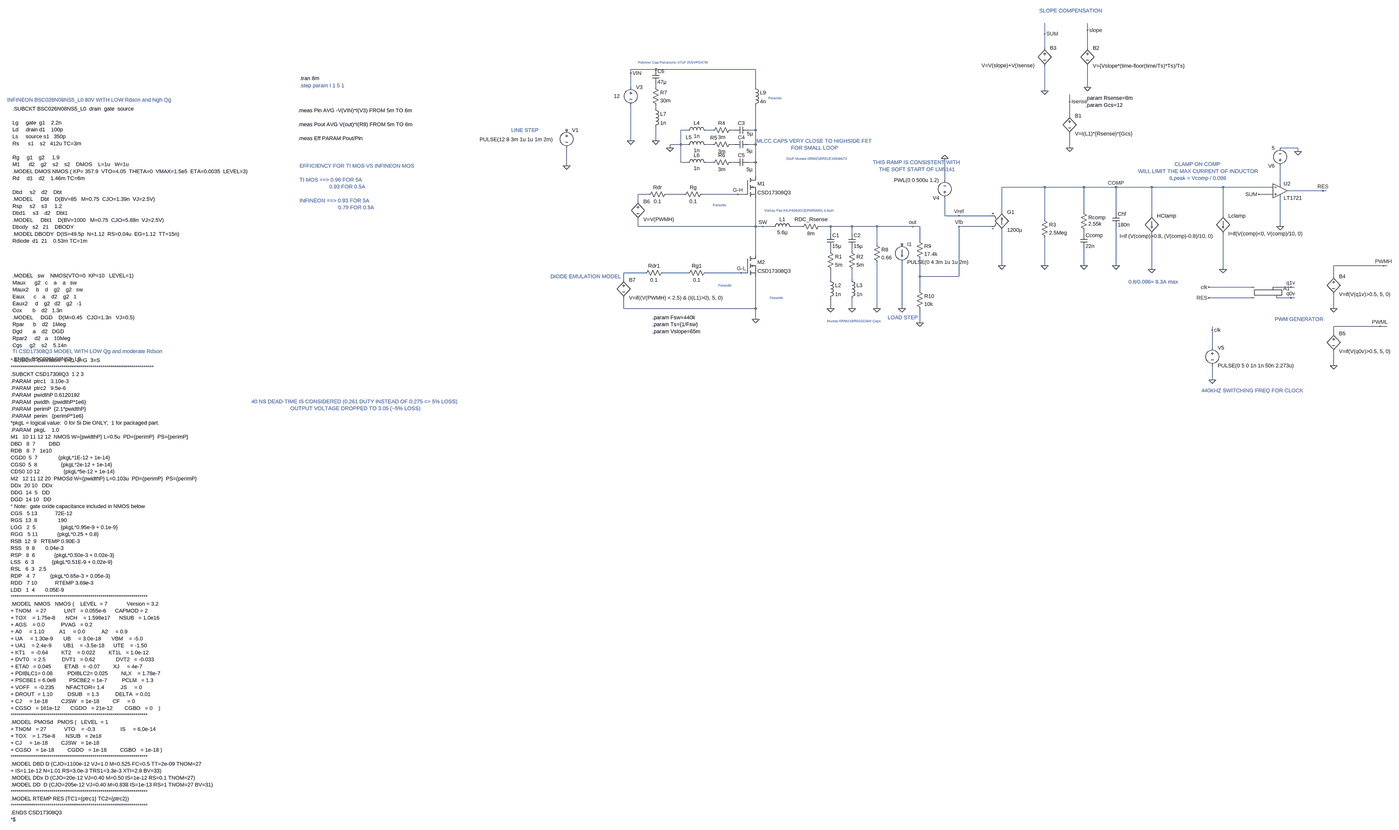
[diagram p0: schematic Synchronos Buck Converter.asc, whole sheet]
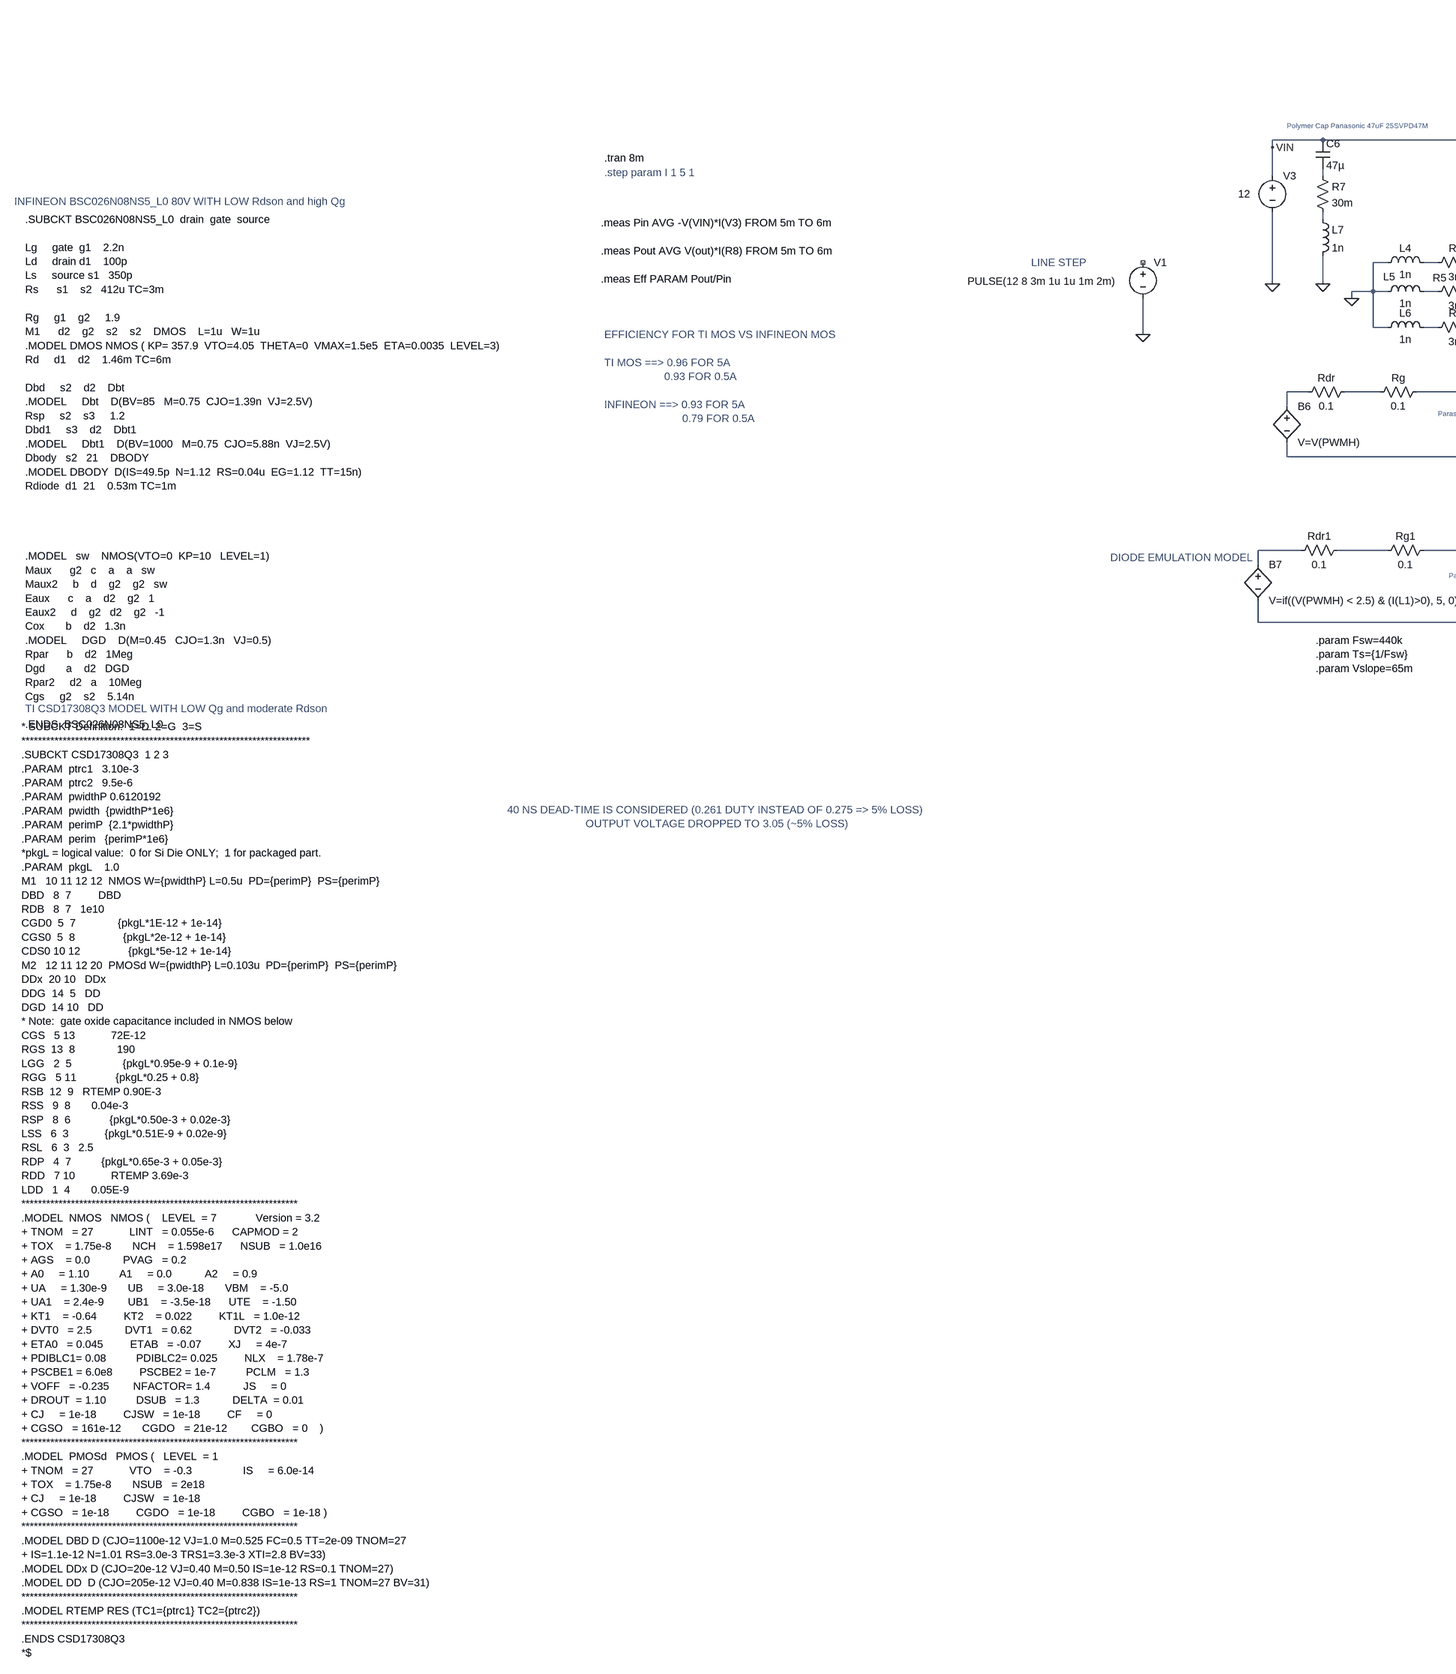
[diagram p1: schematic Synchronos Buck Converter.asc, part, row 1 of 1, column 1 of 2]
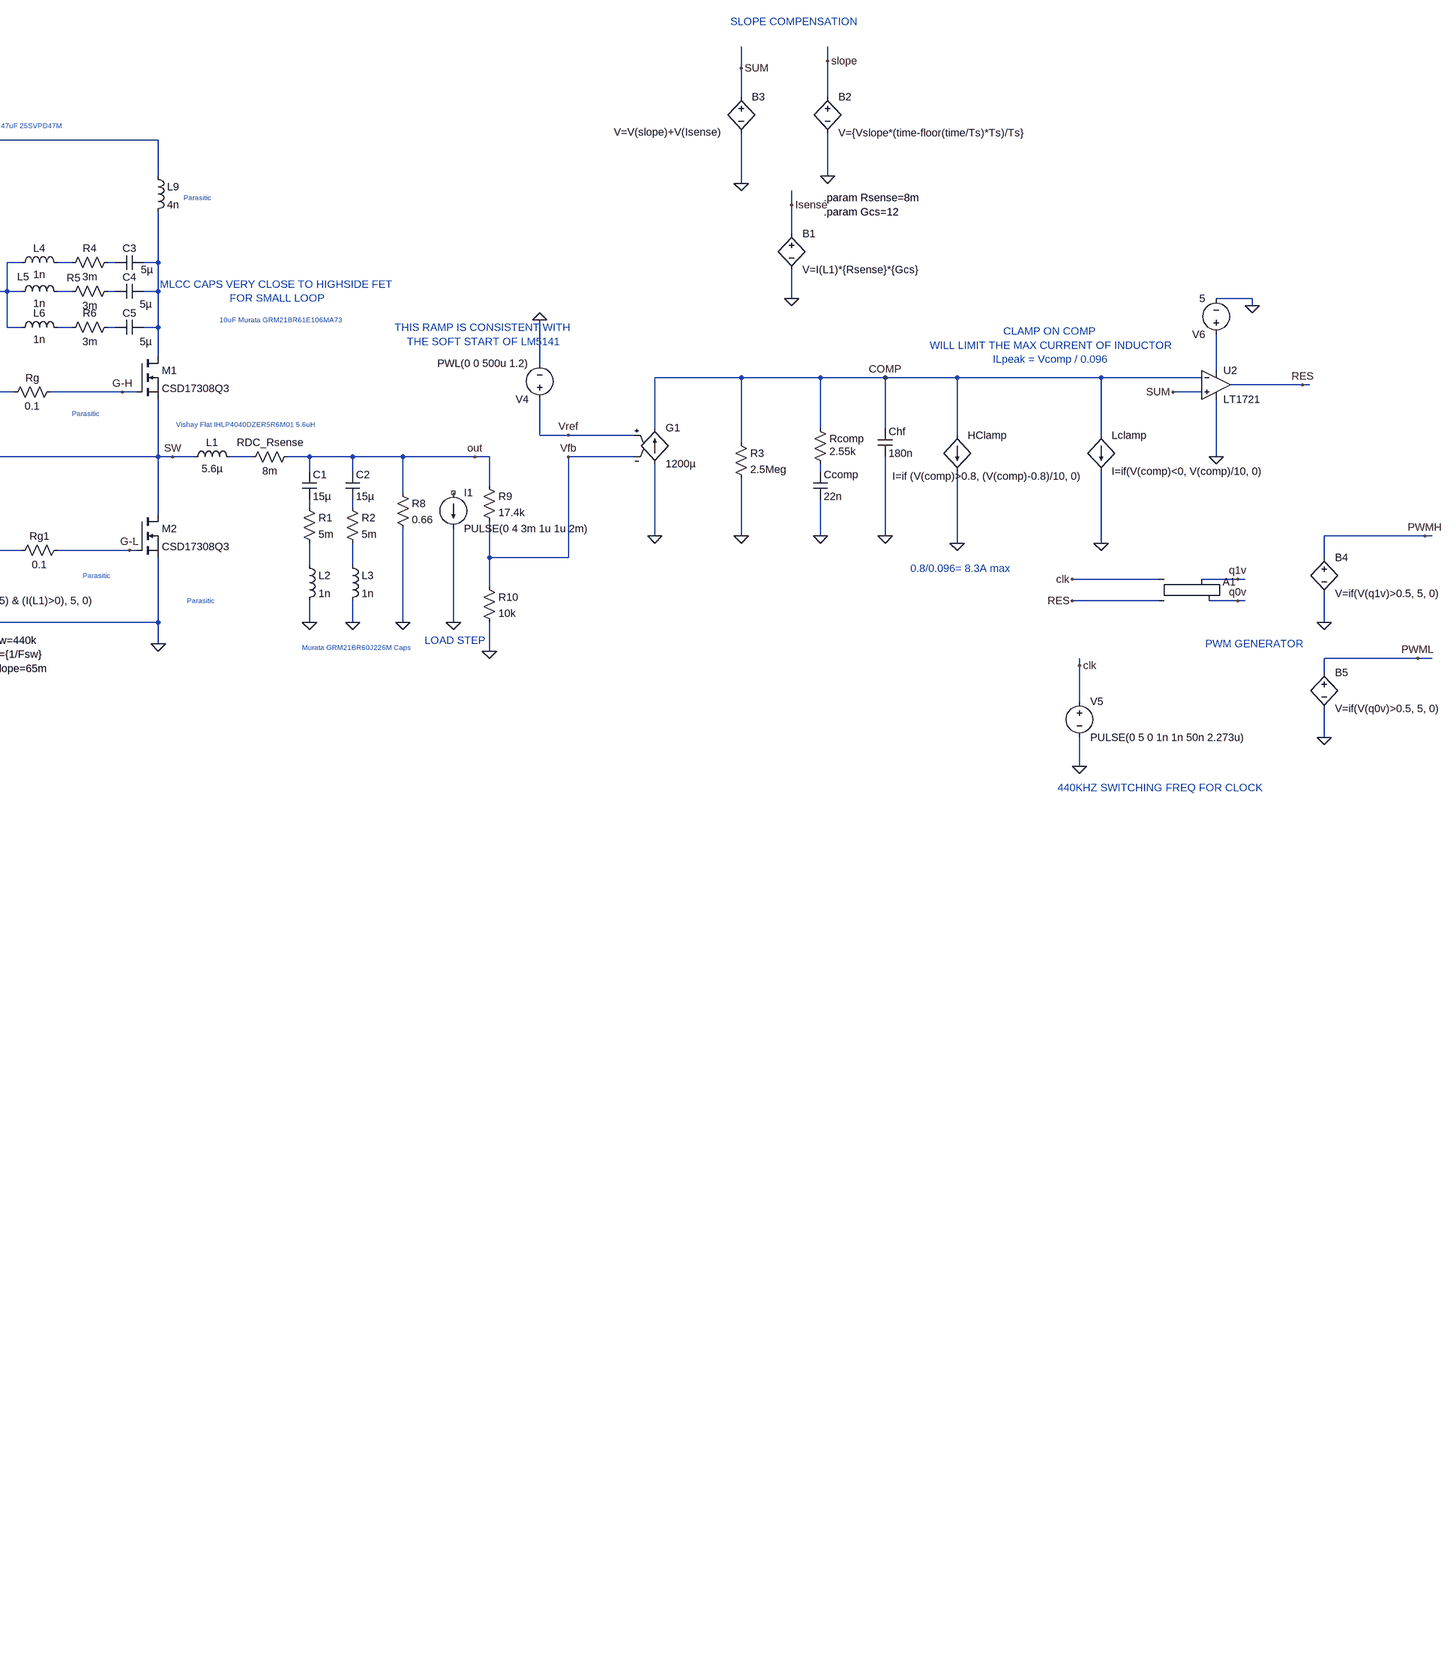
[diagram p2: schematic Synchronos Buck Converter.asc, part, row 1 of 1, column 2 of 2]
Synchronos Buck Converter.asc, the LTspice schematic file:
Version 4.1
SHEET 1 2240 2848
WIRE 848 -496 848 -528
WIRE 656 -480 656 -528
WIRE 656 -416 656 -480
WIRE 848 -416 848 -496
WIRE -1088 -320 -1200 -320
WIRE -640 -320 -1088 -320
WIRE -1200 -304 -1200 -320
WIRE -1200 -240 -1200 -304
WIRE -1088 -240 -1088 -256
WIRE -640 -240 -640 -320
WIRE 848 -240 848 -336
WIRE 656 -224 656 -336
WIRE 768 -176 768 -208
WIRE -1088 -144 -1088 -160
WIRE 768 -112 768 -176
WIRE -944 -48 -976 -48
WIRE -832 -48 -864 -48
WIRE -736 -48 -752 -48
WIRE -640 -48 -640 -160
WIRE -640 -48 -672 -48
WIRE -1200 0 -1200 -160
WIRE -1088 0 -1088 -64
WIRE -976 16 -976 -48
WIRE -976 16 -1024 16
WIRE -944 16 -976 16
WIRE -832 16 -864 16
WIRE -736 16 -752 16
WIRE -640 16 -640 -48
WIRE -640 16 -672 16
WIRE -1024 32 -1024 16
WIRE 768 32 768 -32
WIRE 1792 32 1712 32
WIRE 1792 48 1792 32
WIRE -976 96 -976 16
WIRE -944 96 -976 96
WIRE -832 96 -864 96
WIRE -736 96 -752 96
WIRE -640 96 -640 16
WIRE -640 96 -672 96
WIRE -1488 112 -1488 32
WIRE -640 160 -640 96
WIRE 208 176 208 80
WIRE 1712 192 1712 112
WIRE 656 208 464 208
WIRE 832 208 656 208
WIRE 976 208 832 208
WIRE 1136 208 976 208
WIRE 1456 208 1136 208
WIRE 1680 208 1456 208
WIRE 1904 224 1744 224
WIRE 1920 224 1904 224
WIRE -1120 240 -1168 240
WIRE -960 240 -1040 240
WIRE -720 240 -880 240
WIRE -688 240 -720 240
WIRE 1680 240 1616 240
WIRE -1168 272 -1168 240
WIRE 464 320 464 208
WIRE 832 320 832 208
WIRE 976 320 976 208
WIRE 208 336 208 256
WIRE 272 336 208 336
WIRE 416 336 272 336
WIRE 1136 336 1136 208
WIRE 1456 336 1456 208
WIRE 656 352 656 208
WIRE -1168 384 -1168 352
WIRE -640 384 -640 256
WIRE -640 384 -1168 384
WIRE -608 384 -640 384
WIRE -560 384 -608 384
WIRE -432 384 -480 384
WIRE -304 384 -352 384
WIRE -208 384 -304 384
WIRE -96 384 -208 384
WIRE 64 384 -96 384
WIRE 96 384 64 384
WIRE 416 384 272 384
WIRE 1712 384 1712 256
WIRE -304 416 -304 384
WIRE -208 416 -208 384
WIRE 832 416 832 400
WIRE 96 448 96 384
WIRE -96 464 -96 384
WIRE -304 496 -304 480
WIRE -208 496 -208 480
WIRE -640 512 -640 384
WIRE 464 560 464 400
WIRE 656 560 656 432
WIRE 832 560 832 480
WIRE 976 560 976 384
WIRE 2176 560 1952 560
WIRE 2192 560 2176 560
WIRE 1136 576 1136 416
WIRE 1456 576 1456 416
WIRE -1136 592 -1232 592
WIRE -944 592 -1056 592
WIRE -704 592 -864 592
WIRE -688 592 -704 592
WIRE 96 608 96 528
WIRE 272 608 272 384
WIRE 272 608 96 608
WIRE 1952 608 1952 560
WIRE -1232 624 -1232 592
WIRE -304 624 -304 576
WIRE -208 624 -208 576
WIRE 1584 656 1392 656
WIRE 1760 656 1680 656
WIRE 1776 656 1760 656
WIRE 96 672 96 608
WIRE 1584 704 1392 704
WIRE 1760 704 1696 704
WIRE 1776 704 1760 704
WIRE -1232 752 -1232 704
WIRE -640 752 -640 608
WIRE -640 752 -1232 752
WIRE -304 752 -304 704
WIRE -208 752 -208 704
WIRE -96 752 -96 544
WIRE 16 752 16 544
WIRE 1952 752 1952 688
WIRE -640 800 -640 752
WIRE 96 816 96 752
WIRE 2160 832 1952 832
WIRE 2192 832 2160 832
WIRE 1408 848 1408 832
WIRE 1952 864 1952 832
WIRE 1408 928 1408 848
WIRE 1952 1008 1952 944
WIRE 1408 1072 1408 1008
FLAG -640 800 0
FLAG -1200 0 0
FLAG -304 752 0
FLAG -208 752 0
FLAG -1024 32 0
FLAG -1088 0 0
FLAG -720 240 G-H
FLAG -704 592 G-L
FLAG -608 384 SW
FLAG 272 336 Vref
FLAG 272 384 Vfb
FLAG 976 208 COMP
FLAG 464 560 0
FLAG 208 80 0
FLAG 96 816 0
FLAG 832 560 0
FLAG 976 560 0
FLAG 1408 848 clk
FLAG 1408 1072 0
FLAG 768 32 0
FLAG 768 -176 Isense
FLAG -96 752 0
FLAG 848 -496 slope
FLAG 848 -240 0
FLAG 656 -224 0
FLAG 656 -480 SUM
FLAG 656 560 0
FLAG 1616 240 SUM
FLAG 1792 48 0
FLAG 1904 224 RES
FLAG 1392 656 clk
FLAG 1392 704 RES
FLAG 1760 656 q1v
FLAG 1952 752 0
FLAG 2176 560 PWMH
FLAG 1952 1008 0
FLAG 1760 704 q0v
FLAG 2160 832 PWML
FLAG 64 384 out
FLAG 1712 384 0
FLAG 16 752 0
FLAG 1136 576 0
FLAG 1456 576 0
FLAG -1488 112 0
FLAG -1200 -304 VIN
DATAFLAG 848 -448 ""
SYMBOL voltage -1200 -256 R0
WINDOW 123 0 0 Left 0
WINDOW 39 0 0 Left 0
WINDOW 3 -76 56 Left 2
SYMATTR Value 12
SYMATTR InstName V3
SYMBOL nmos -688 160 R0
SYMATTR InstName M1
SYMATTR Value CSD17308Q3
SYMATTR Prefix X
SYMBOL nmos -688 512 R0
SYMATTR InstName M2
SYMATTR Value CSD17308Q3
SYMATTR Prefix X
SYMBOL ind -576 400 R270
WINDOW 0 32 56 VTop 2
WINDOW 3 5 56 VBottom 2
SYMATTR InstName L1
SYMATTR Value 5.6µ
SYMATTR SpiceLine Rser=1m
SYMBOL cap -320 416 R0
SYMATTR InstName C1
SYMATTR Value 15µ
SYMBOL cap -224 416 R0
SYMATTR InstName C2
SYMATTR Value 15µ
SYMBOL res -320 480 R0
SYMATTR InstName R1
SYMATTR Value 5m
SYMBOL ind -320 608 R0
SYMATTR InstName L2
SYMATTR Value 1n
SYMATTR SpiceLine Rser=0
SYMBOL ind -224 608 R0
SYMATTR InstName L3
SYMATTR Value 1n
SYMATTR SpiceLine Rser=0
SYMBOL res -224 480 R0
SYMATTR InstName R2
SYMATTR Value 5m
SYMBOL res -336 368 R90
WINDOW 0 0 56 VBottom 2
WINDOW 3 32 56 VTop 2
SYMATTR InstName RDC_Rsense
SYMATTR Value 8m
SYMBOL cap -672 -64 R90
WINDOW 0 0 32 VBottom 2
WINDOW 3 16 -7 VTop 2
SYMATTR InstName C3
SYMATTR Value 5µ
SYMBOL cap -672 0 R90
WINDOW 0 0 32 VBottom 2
WINDOW 3 29 -4 VTop 2
SYMATTR InstName C4
SYMATTR Value 5µ
SYMBOL cap -672 80 R90
WINDOW 0 0 32 VBottom 2
WINDOW 3 32 -4 VTop 2
SYMATTR InstName C5
SYMATTR Value 5µ
SYMBOL res -736 -64 R90
WINDOW 0 0 56 VBottom 2
WINDOW 3 32 56 VTop 2
SYMATTR InstName R4
SYMATTR Value 3m
SYMBOL ind -960 -32 R270
WINDOW 0 32 56 VTop 2
WINDOW 3 5 56 VBottom 2
SYMATTR InstName L4
SYMATTR Value 1n
SYMATTR SpiceLine Rser=0
SYMBOL ind -960 32 R270
WINDOW 0 33 20 VTop 2
WINDOW 3 5 56 VBottom 2
SYMATTR InstName L5
SYMATTR Value 1n
SYMATTR SpiceLine Rser=0
SYMBOL ind -960 112 R270
WINDOW 0 32 56 VTop 2
WINDOW 3 5 56 VBottom 2
SYMATTR InstName L6
SYMATTR Value 1n
SYMATTR SpiceLine Rser=0
SYMBOL res -736 0 R90
WINDOW 0 2 92 VBottom 2
WINDOW 3 32 56 VTop 2
SYMATTR InstName R5
SYMATTR Value 3m
SYMBOL res -736 80 R90
WINDOW 0 0 56 VBottom 2
WINDOW 3 32 56 VTop 2
SYMATTR InstName R6
SYMATTR Value 3m
SYMBOL cap -1104 -320 R0
SYMATTR InstName C6
SYMATTR Value 47µ
SYMBOL res -1104 -256 R0
SYMATTR InstName R7
SYMATTR Value 30m
SYMBOL ind -1104 -160 R0
SYMATTR InstName L7
SYMATTR Value 1n
SYMATTR SpiceLine Rser=0
SYMBOL res -1024 224 R90
WINDOW 0 0 56 VBottom 2
WINDOW 3 32 56 VTop 2
SYMATTR InstName Rdr
SYMATTR Value 0.1
SYMBOL res -864 224 R90
WINDOW 0 0 56 VBottom 2
WINDOW 3 32 56 VTop 2
SYMATTR InstName Rg
SYMATTR Value 0.1
SYMBOL res -1040 576 R90
WINDOW 0 0 56 VBottom 2
WINDOW 3 32 56 VTop 2
SYMATTR InstName Rdr1
SYMATTR Value 0.1
SYMBOL res -848 576 R90
WINDOW 0 0 56 VBottom 2
WINDOW 3 32 56 VTop 2
SYMATTR InstName Rg1
SYMATTR Value 0.1
SYMBOL ind -656 -256 R0
SYMATTR InstName L9
SYMATTR Value 4n
SYMATTR SpiceLine Rser=1m
SYMBOL g 464 304 R0
SYMATTR InstName G1
SYMATTR Value 1200µ
SYMBOL voltage 208 272 R180
WINDOW 123 0 0 Left 0
WINDOW 39 0 0 Left 0
SYMATTR InstName V4
SYMATTR Value PWL(0 0 500u 1.2)
SYMBOL res 80 432 R0
SYMATTR InstName R9
SYMATTR Value 17.4k
SYMBOL res 80 656 R0
SYMATTR InstName R10
SYMATTR Value 10k
SYMBOL res 816 304 R0
WINDOW 3 36 68 Left 2
SYMATTR Value 2.55k
SYMATTR InstName Rcomp
SYMBOL cap 960 320 R0
SYMATTR InstName Chf
SYMATTR Value 180n
SYMBOL cap 816 416 R0
SYMATTR InstName Ccomp
SYMATTR Value 22n
SYMBOL voltage 1408 912 R0
WINDOW 123 0 0 Left 0
WINDOW 39 0 0 Left 0
SYMATTR InstName V5
SYMATTR Value PULSE(0 5 0 1n 1n 50n 2.273u)
SYMBOL bv 768 -128 R0
SYMATTR InstName B1
SYMATTR Value V=I(L1)*{Rsense}*{Gcs}
SYMBOL bv 848 -432 R0
SYMATTR InstName B2
SYMATTR Value V={Vslope*(time-floor(time/Ts)*Ts)/Ts}
SYMBOL bv 656 -432 R0
WINDOW 3 -283 94 Left 2
SYMATTR Value V=V(slope)+V(Isense)
SYMATTR InstName B3
SYMBOL res 640 336 R0
SYMATTR InstName R3
SYMATTR Value 2.5Meg
SYMBOL voltage 1712 128 R180
WINDOW 123 0 0 Left 0
WINDOW 39 0 0 Left 0
SYMATTR InstName V6
SYMATTR Value 5
SYMBOL Digital\\srflop 1632 608 R0
SYMATTR InstName A1
SYMBOL bv 1952 592 R0
SYMATTR InstName B4
SYMATTR Value V=if(V(q1v)>0.5, 5, 0)
SYMBOL bv 1952 848 R0
SYMATTR InstName B5
SYMATTR Value V=if(V(q0v)>0.5, 5, 0)
SYMBOL bv -1168 256 R0
SYMATTR InstName B6
SYMATTR Value V=V(PWMH)
SYMBOL bv -1232 608 R0
SYMATTR InstName B7
SYMATTR Value V=if((V(PWMH) < 2.5) & (I(L1)>0), 5, 0)
SYMBOL Comparators\\LT1721 1712 160 R0
SYMATTR InstName U2
SYMBOL res -112 448 R0
SYMATTR InstName R8
SYMATTR Value 0.66
SYMBOL current 16 464 R0
WINDOW 123 0 0 Left 0
WINDOW 39 0 0 Left 0
SYMATTR InstName I1
SYMATTR Value PULSE(0 4 3m 1u 1u 2m)
SYMBOL bi 1136 336 R0
WINDOW 3 -144 91 Left 2
SYMATTR Value I=if (V(comp)>0.8, (V(comp)-0.8)/10, 0)
SYMATTR InstName HClamp
SYMBOL bi 1456 336 R0
SYMATTR InstName Lclamp
SYMATTR Value I=if(V(comp)<0, V(comp)/10, 0)
SYMBOL voltage -1488 -64 R0
WINDOW 123 0 0 Left 0
WINDOW 39 0 0 Left 0
WINDOW 3 -390 58 Left 2
SYMATTR Value PULSE(12 8 3m 1u 1u 1m 2m)
SYMATTR InstName V1
TEXT -4048 -144 Left 2 !.SUBCKT BSC026N08NS5_L0  drain  gate  source\n \nLg     gate  g1    2.2n\nLd     drain d1    100p\nLs     source s1   350p\nRs      s1    s2   412u TC=3m\n \nRg     g1    g2     1.9\nM1      d2    g2    s2    s2    DMOS    L=1u   W=1u\n.MODEL DMOS NMOS ( KP= 357.9  VTO=4.05  THETA=0  VMAX=1.5e5  ETA=0.0035  LEVEL=3)\nRd     d1    d2    1.46m TC=6m\n \nDbd     s2    d2    Dbt\n.MODEL     Dbt    D(BV=85   M=0.75  CJO=1.39n  VJ=2.5V)\nRsp     s2    s3     1.2\nDbd1     s3    d2    Dbt1\n.MODEL     Dbt1    D(BV=1000   M=0.75  CJO=5.88n  VJ=2.5V)\nDbody   s2   21    DBODY\n.MODEL DBODY  D(IS=49.5p  N=1.12  RS=0.04u  EG=1.12  TT=15n)\nRdiode  d1  21    0.53m TC=1m\n \n \n \n \n.MODEL   sw    NMOS(VTO=0  KP=10   LEVEL=1)\nMaux      g2   c    a    a   sw\nMaux2     b    d    g2    g2   sw\nEaux      c    a    d2    g2   1\nEaux2     d    g2   d2    g2   -1\nCox       b    d2   1.3n\n.MODEL     DGD    D(M=0.45   CJO=1.3n   VJ=0.5)\nRpar      b    d2   1Meg\nDgd       a    d2   DGD\nRpar2     d2   a    10Meg\nCgs     g2    s2    5.14n\n \n.ENDS  BSC026N08NS5_L0
TEXT -4072 -184 Left 2 ;INFINEON BSC026N08NS5_L0 80V WITH LOW Rdson and high Qg
TEXT -2760 -280 Left 2 !.tran 8m
TEXT -2512 1184 Center 2 ;40 NS DEAD-TIME IS CONSIDERED (0.261 DUTY INSTEAD OF 0.275 => 5% LOSS) \nOUTPUT VOLTAGE DROPPED TO 3.05 (~5% LOSS)
TEXT -2768 -136 Left 2 !.meas Pin AVG -V(VIN)*I(V3) FROM 5m TO 6m\n \n.meas Pout AVG V(out)*I(R8) FROM 5m TO 6m\n \n.meas Eff PARAM Pout/Pin
TEXT -2760 -248 Left 2 ;.step param I 1 5 1
TEXT -320 808 Left 1 ;Murata GRM21BR60J226M Caps
TEXT -600 312 Left 1 ;Vishay Flat IHLP4040DZER5R6M01 5.6uH
TEXT -376 16 Center 2 ;MLCC CAPS VERY CLOSE TO HIGHSIDE FET \nFOR SMALL LOOP
TEXT -504 80 Left 1 ;10uF Murata GRM21BR61E106MA73
TEXT -1168 -352 Left 1 ;Polymer Cap Panasonic 47uF 25SVPD47M
TEXT -832 288 Left 1 ;Parasitic
TEXT -584 -192 Left 1 ;Parasitic
TEXT -576 704 Left 1 ;Parasitic
TEXT -808 648 Left 1 ;Parasitic
TEXT 840 -192 Left 2 !.param Rsense=8m
TEXT 840 -160 Left 2 !.param Gcs=12
TEXT -1104 792 Left 2 !.param Fsw=440k\n.param Ts={1/Fsw}\n.param Vslope=65m
TEXT 632 -584 Left 2 ;SLOPE COMPENSATION
TEXT 1688 800 Left 2 ;PWM GENERATOR
TEXT 1360 1120 Left 2 ;440KHZ SWITCHING FREQ FOR CLOCK
TEXT 1344 136 Center 2 ;CLAMP ON COMP \nWILL LIMIT THE MAX CURRENT OF INDUCTOR\nILpeak = Vcomp / 0.096
TEXT 1032 632 Left 2 ;0.8/0.096= 8.3A max
TEXT -48 792 Left 2 ;LOAD STEP
TEXT -1736 -48 Left 2 ;LINE STEP
TEXT 80 112 Center 2 ;THIS RAMP IS CONSISTENT WITH\n THE SOFT START OF LM5141
TEXT -1560 608 Left 2 ;DIODE EMULATION MODEL
TEXT -4056 984 Left 2 !* SUBCKT Definition:  1=D  2=G  3=S\n**********************************************************************\n.SUBCKT CSD17308Q3  1 2 3\n.PARAM  ptrc1   3.10e-3  \n.PARAM  ptrc2   9.5e-6\n.PARAM  pwidthP 0.6120192\n.PARAM  pwidth  {pwidthP*1e6}\n.PARAM  perimP  {2.1*pwidthP}\n.PARAM  perim   {perimP*1e6}\n*pkgL = logical value:  0 for Si Die ONLY;  1 for packaged part.\n.PARAM  pkgL    1.0\nM1   10 11 12 12  NMOS W={pwidthP} L=0.5u  PD={perimP}  PS={perimP}\nDBD   8  7         DBD\nRDB   8  7   1e10\nCGD0  5  7              {pkgL*1E-12 + 1e-14}\nCGS0  5  8                {pkgL*2e-12 + 1e-14}\nCDS0 10 12                {pkgL*5e-12 + 1e-14}\nM2   12 11 12 20  PMOSd W={pwidthP} L=0.103u  PD={perimP}  PS={perimP}\nDDx  20 10   DDx\nDDG  14  5   DD\nDGD  14 10   DD\n* Note:  gate oxide capacitance included in NMOS below\nCGS   5 13            72E-12\nRGS  13  8              190\nLGG   2  5                 {pkgL*0.95e-9 + 0.1e-9}\nRGG   5 11             {pkgL*0.25 + 0.8}\nRSB  12  9   RTEMP 0.90E-3\nRSS   9  8       0.04e-3\nRSP   8  6             {pkgL*0.50e-3 + 0.02e-3}\nLSS   6  3            {pkgL*0.51E-9 + 0.02e-9}\nRSL   6  3   2.5\nRDP   4  7          {pkgL*0.65e-3 + 0.05e-3}\nRDD   7 10            RTEMP 3.69e-3\nLDD   1  4       0.05E-9\n******************************************************************* \n.MODEL  NMOS   NMOS (    LEVEL  = 7             Version = 3.2\n+ TNOM   = 27            LINT   = 0.055e-6      CAPMOD = 2\n+ TOX    = 1.75e-8       NCH    = 1.598e17      NSUB   = 1.0e16\n+ AGS    = 0.0           PVAG   = 0.2\n+ A0     = 1.10          A1     = 0.0           A2     = 0.9\n+ UA     = 1.30e-9       UB     = 3.0e-18       VBM    = -5.0\n+ UA1    = 2.4e-9        UB1    = -3.5e-18      UTE    = -1.50\n+ KT1    = -0.64         KT2    = 0.022         KT1L   = 1.0e-12\n+ DVT0   = 2.5           DVT1   = 0.62              DVT2   = -0.033\n+ ETA0   = 0.045         ETAB   = -0.07         XJ     = 4e-7\n+ PDIBLC1= 0.08          PDIBLC2= 0.025         NLX    = 1.78e-7\n+ PSCBE1 = 6.0e8         PSCBE2 = 1e-7          PCLM   = 1.3\n+ VOFF   = -0.235        NFACTOR= 1.4           JS     = 0\n+ DROUT  = 1.10          DSUB   = 1.3           DELTA  = 0.01\n+ CJ     = 1e-18         CJSW   = 1e-18         CF     = 0\n+ CGSO   = 161e-12       CGDO   = 21e-12        CGBO   = 0    )\n******************************************************************* \n.MODEL  PMOSd   PMOS (   LEVEL  = 1\n+ TNOM   = 27            VTO    = -0.3                 IS     = 6.0e-14\n+ TOX    = 1.75e-8       NSUB   = 2e18\n+ CJ     = 1e-18         CJSW   = 1e-18\n+ CGSO   = 1e-18         CGDO   = 1e-18         CGBO   = 1e-18 )\n******************************************************************* \n.MODEL DBD D (CJO=1100e-12 VJ=1.0 M=0.525 FC=0.5 TT=2e-09 TNOM=27\n+ IS=1.1e-12 N=1.01 RS=3.0e-3 TRS1=3.3e-3 XTI=2.8 BV=33)\n.MODEL DDx D (CJO=20e-12 VJ=0.40 M=0.50 IS=1e-12 RS=0.1 TNOM=27)\n.MODEL DD  D (CJO=205e-12 VJ=0.40 M=0.838 IS=1e-13 RS=1 TNOM=27 BV=31)\n******************************************************************* \n.MODEL RTEMP RES (TC1={ptrc1} TC2={ptrc2})\n*******************************************************************\n.ENDS CSD17308Q3\n*$
TEXT -4048 944 Left 2 ;TI CSD17308Q3 MODEL WITH LOW Qg and moderate Rdson
TEXT -2760 112 Left 2 ;EFFICIENCY FOR TI MOS VS INFINEON MOS\n \nTI MOS ==> 0.96 FOR 5A\n                    0.93 FOR 0.5A\n \nINFINEON ==> 0.93 FOR 5A\n                          0.79 FOR 0.5A

The netlist it stands for:
* Synchronos Buck Converter.asc
V3 VIN 0 12
X§M1 N005 G-H SW CSD17308Q3  ; pins D G S
X§M2 SW G-L 0 CSD17308Q3  ; pins D G S
L1 SW N013 5.6µ Rser=1m
C1 out N015 15µ
C2 out N016 15µ
R1 N015 N019 5m
L2 N019 0 1n Rser=0
L3 N020 0 1n Rser=0
R2 N016 N020 5m
RDC_Rsense out N013 8m
C3 N005 N004 5µ
C4 N005 N007 5µ
C5 N005 N009 5µ
R4 N004 N003 3m
L4 0 N003 1n Rser=0
L5 0 N006 1n Rser=0
L6 0 N008 1n Rser=0
R5 N007 N006 3m
R6 N009 N008 3m
C6 VIN N001 47µ
R7 N001 N002 30m
L7 N002 0 1n Rser=0
Rdr N012 N011 0.1
Rg G-H N012 0.1
Rdr1 N018 N017 0.1
Rg1 G-L N018 0.1
L9 VIN N005 4n Rser=1m
G1 0 COMP Vref Vfb 1200µ
V4 Vref 0 PWL(0 0 500u 1.2)
R9 out Vfb 17.4k
R10 Vfb 0 10k
Rcomp COMP N014 2.55k
Chf COMP 0 180n
Ccomp N014 0 22n
V5 clk 0 PULSE(0 5 0 1n 1n 50n 2.273u)
B1 Isense 0 V=I(L1)*{Rsense}*{Gcs}
B2 slope 0 V={Vslope*(time-floor(time/Ts)*Ts)/Ts}
B3 SUM 0 V=V(slope)+V(Isense)
R3 COMP 0 2.5Meg
V6 N010 0 5
A1 clk RES 0 0 0 q0v q1v 0 SRFLOP
B4 PWMH 0 V=if(V(q1v)>0.5, 5, 0)
B5 PWML 0 V=if(V(q0v)>0.5, 5, 0)
B6 N011 SW V=V(PWMH)
B7 N017 0 V=if((V(PWMH) < 2.5) & (I(L1)>0), 5, 0)
X§U2 SUM COMP N010 0 RES LT1720  ; LT1721, pins In+ In- V+ V- OUT
R8 out 0 0.66
I1 NC_01 0 PULSE(0 4 3m 1u 1u 2m)
B§HClamp COMP 0 I=if (V(comp)>0.8, (V(comp)-0.8)/10, 0)
B§Lclamp COMP 0 I=if(V(comp)<0, V(comp)/10, 0)
V1 NC_02 0 PULSE(12 8 3m 1u 1u 1m 2m)
.SUBCKT BSC026N08NS5_L0  drain  gate  source
Lg     gate  g1    2.2n
Ld     drain d1    100p
Ls     source s1   350p
Rs      s1    s2   412u TC=3m
Rg     g1    g2     1.9
M1      d2    g2    s2    s2    DMOS    L=1u   W=1u
.MODEL DMOS NMOS ( KP= 357.9  VTO=4.05  THETA=0  VMAX=1.5e5  ETA=0.0035  LEVEL=3)
Rd     d1    d2    1.46m TC=6m
Dbd     s2    d2    Dbt
.MODEL     Dbt    D(BV=85   M=0.75  CJO=1.39n  VJ=2.5V)
Rsp     s2    s3     1.2
Dbd1     s3    d2    Dbt1
.MODEL     Dbt1    D(BV=1000   M=0.75  CJO=5.88n  VJ=2.5V)
Dbody   s2   21    DBODY
.MODEL DBODY  D(IS=49.5p  N=1.12  RS=0.04u  EG=1.12  TT=15n)
Rdiode  d1  21    0.53m TC=1m
.MODEL   sw    NMOS(VTO=0  KP=10   LEVEL=1)
Maux      g2   c    a    a   sw
Maux2     b    d    g2    g2   sw
Eaux      c    a    d2    g2   1
Eaux2     d    g2   d2    g2   -1
Cox       b    d2   1.3n
.MODEL     DGD    D(M=0.45   CJO=1.3n   VJ=0.5)
Rpar      b    d2   1Meg
Dgd       a    d2   DGD
Rpar2     d2   a    10Meg
Cgs     g2    s2    5.14n
.ENDS  BSC026N08NS5_L0
* INFINEON BSC026N08NS5_L0 80V WITH LOW Rdson and high Qg
.tran 8m
* 40 NS DEAD-TIME IS CONSIDERED (0.261 DUTY INSTEAD OF 0.275 => 5% LOSS)
* OUTPUT VOLTAGE DROPPED TO 3.05 (~5% LOSS)
.meas Pin AVG -V(VIN)*I(V3) FROM 5m TO 6m
.meas Pout AVG V(out)*I(R8) FROM 5m TO 6m
.meas Eff PARAM Pout/Pin
* .step param I 1 5 1
* Murata GRM21BR60J226M Caps
* Vishay Flat IHLP4040DZER5R6M01 5.6uH
* MLCC CAPS VERY CLOSE TO HIGHSIDE FET
* FOR SMALL LOOP
* 10uF Murata GRM21BR61E106MA73
* Polymer Cap Panasonic 47uF 25SVPD47M
* Parasitic
* Parasitic
* Parasitic
* Parasitic
.param Rsense=8m
.param Gcs=12
.param Fsw=440k
.param Ts={1/Fsw}
.param Vslope=65m
* SLOPE COMPENSATION
* PWM GENERATOR
* 440KHZ SWITCHING FREQ FOR CLOCK
* CLAMP ON COMP
* WILL LIMIT THE MAX CURRENT OF INDUCTOR
* ILpeak = Vcomp / 0.096
* 0.8/0.096= 8.3A max
* LOAD STEP
* LINE STEP
* THIS RAMP IS CONSISTENT WITH
*  THE SOFT START OF LM5141
* DIODE EMULATION MODEL
* SUBCKT Definition:  1=D  2=G  3=S
**********************************************************************
.SUBCKT CSD17308Q3  1 2 3
.PARAM  ptrc1   3.10e-3
.PARAM  ptrc2   9.5e-6
.PARAM  pwidthP 0.6120192
.PARAM  pwidth  {pwidthP*1e6}
.PARAM  perimP  {2.1*pwidthP}
.PARAM  perim   {perimP*1e6}
*pkgL = logical value:  0 for Si Die ONLY;  1 for packaged part.
.PARAM  pkgL    1.0
M1   10 11 12 12  NMOS W={pwidthP} L=0.5u  PD={perimP}  PS={perimP}
DBD   8  7         DBD
RDB   8  7   1e10
CGD0  5  7              {pkgL*1E-12 + 1e-14}
CGS0  5  8                {pkgL*2e-12 + 1e-14}
CDS0 10 12                {pkgL*5e-12 + 1e-14}
M2   12 11 12 20  PMOSd W={pwidthP} L=0.103u  PD={perimP}  PS={perimP}
DDx  20 10   DDx
DDG  14  5   DD
DGD  14 10   DD
* Note:  gate oxide capacitance included in NMOS below
CGS   5 13            72E-12
RGS  13  8              190
LGG   2  5                 {pkgL*0.95e-9 + 0.1e-9}
RGG   5 11             {pkgL*0.25 + 0.8}
RSB  12  9   RTEMP 0.90E-3
RSS   9  8       0.04e-3
RSP   8  6             {pkgL*0.50e-3 + 0.02e-3}
LSS   6  3            {pkgL*0.51E-9 + 0.02e-9}
RSL   6  3   2.5
RDP   4  7          {pkgL*0.65e-3 + 0.05e-3}
RDD   7 10            RTEMP 3.69e-3
LDD   1  4       0.05E-9
*******************************************************************
.MODEL  NMOS   NMOS (    LEVEL  = 7             Version = 3.2
+ TNOM   = 27            LINT   = 0.055e-6      CAPMOD = 2
+ TOX    = 1.75e-8       NCH    = 1.598e17      NSUB   = 1.0e16
+ AGS    = 0.0           PVAG   = 0.2
+ A0     = 1.10          A1     = 0.0           A2     = 0.9
+ UA     = 1.30e-9       UB     = 3.0e-18       VBM    = -5.0
+ UA1    = 2.4e-9        UB1    = -3.5e-18      UTE    = -1.50
+ KT1    = -0.64         KT2    = 0.022         KT1L   = 1.0e-12
+ DVT0   = 2.5           DVT1   = 0.62              DVT2   = -0.033
+ ETA0   = 0.045         ETAB   = -0.07         XJ     = 4e-7
+ PDIBLC1= 0.08          PDIBLC2= 0.025         NLX    = 1.78e-7
+ PSCBE1 = 6.0e8         PSCBE2 = 1e-7          PCLM   = 1.3
+ VOFF   = -0.235        NFACTOR= 1.4           JS     = 0
+ DROUT  = 1.10          DSUB   = 1.3           DELTA  = 0.01
+ CJ     = 1e-18         CJSW   = 1e-18         CF     = 0
+ CGSO   = 161e-12       CGDO   = 21e-12        CGBO   = 0    )
*******************************************************************
.MODEL  PMOSd   PMOS (   LEVEL  = 1
+ TNOM   = 27            VTO    = -0.3                 IS     = 6.0e-14
+ TOX    = 1.75e-8       NSUB   = 2e18
+ CJ     = 1e-18         CJSW   = 1e-18
+ CGSO   = 1e-18         CGDO   = 1e-18         CGBO   = 1e-18 )
*******************************************************************
.MODEL DBD D (CJO=1100e-12 VJ=1.0 M=0.525 FC=0.5 TT=2e-09 TNOM=27
+ IS=1.1e-12 N=1.01 RS=3.0e-3 TRS1=3.3e-3 XTI=2.8 BV=33)
.MODEL DDx D (CJO=20e-12 VJ=0.40 M=0.50 IS=1e-12 RS=0.1 TNOM=27)
.MODEL DD  D (CJO=205e-12 VJ=0.40 M=0.838 IS=1e-13 RS=1 TNOM=27 BV=31)
*******************************************************************
.MODEL RTEMP RES (TC1={ptrc1} TC2={ptrc2})
*******************************************************************
.ENDS CSD17308Q3
*$
* TI CSD17308Q3 MODEL WITH LOW Qg and moderate Rdson
* EFFICIENCY FOR TI MOS VS INFINEON MOS
* TI MOS ==> 0.96 FOR 5A
*                     0.93 FOR 0.5A
* INFINEON ==> 0.93 FOR 5A
*                           0.79 FOR 0.5A
.lib LTC.lib
.backanno
.end